# EAGLE design Parallel CS Prototype (EAGLE 7.2.0)

## Sheet 1 of 4: Inputs & FSYNC Switching
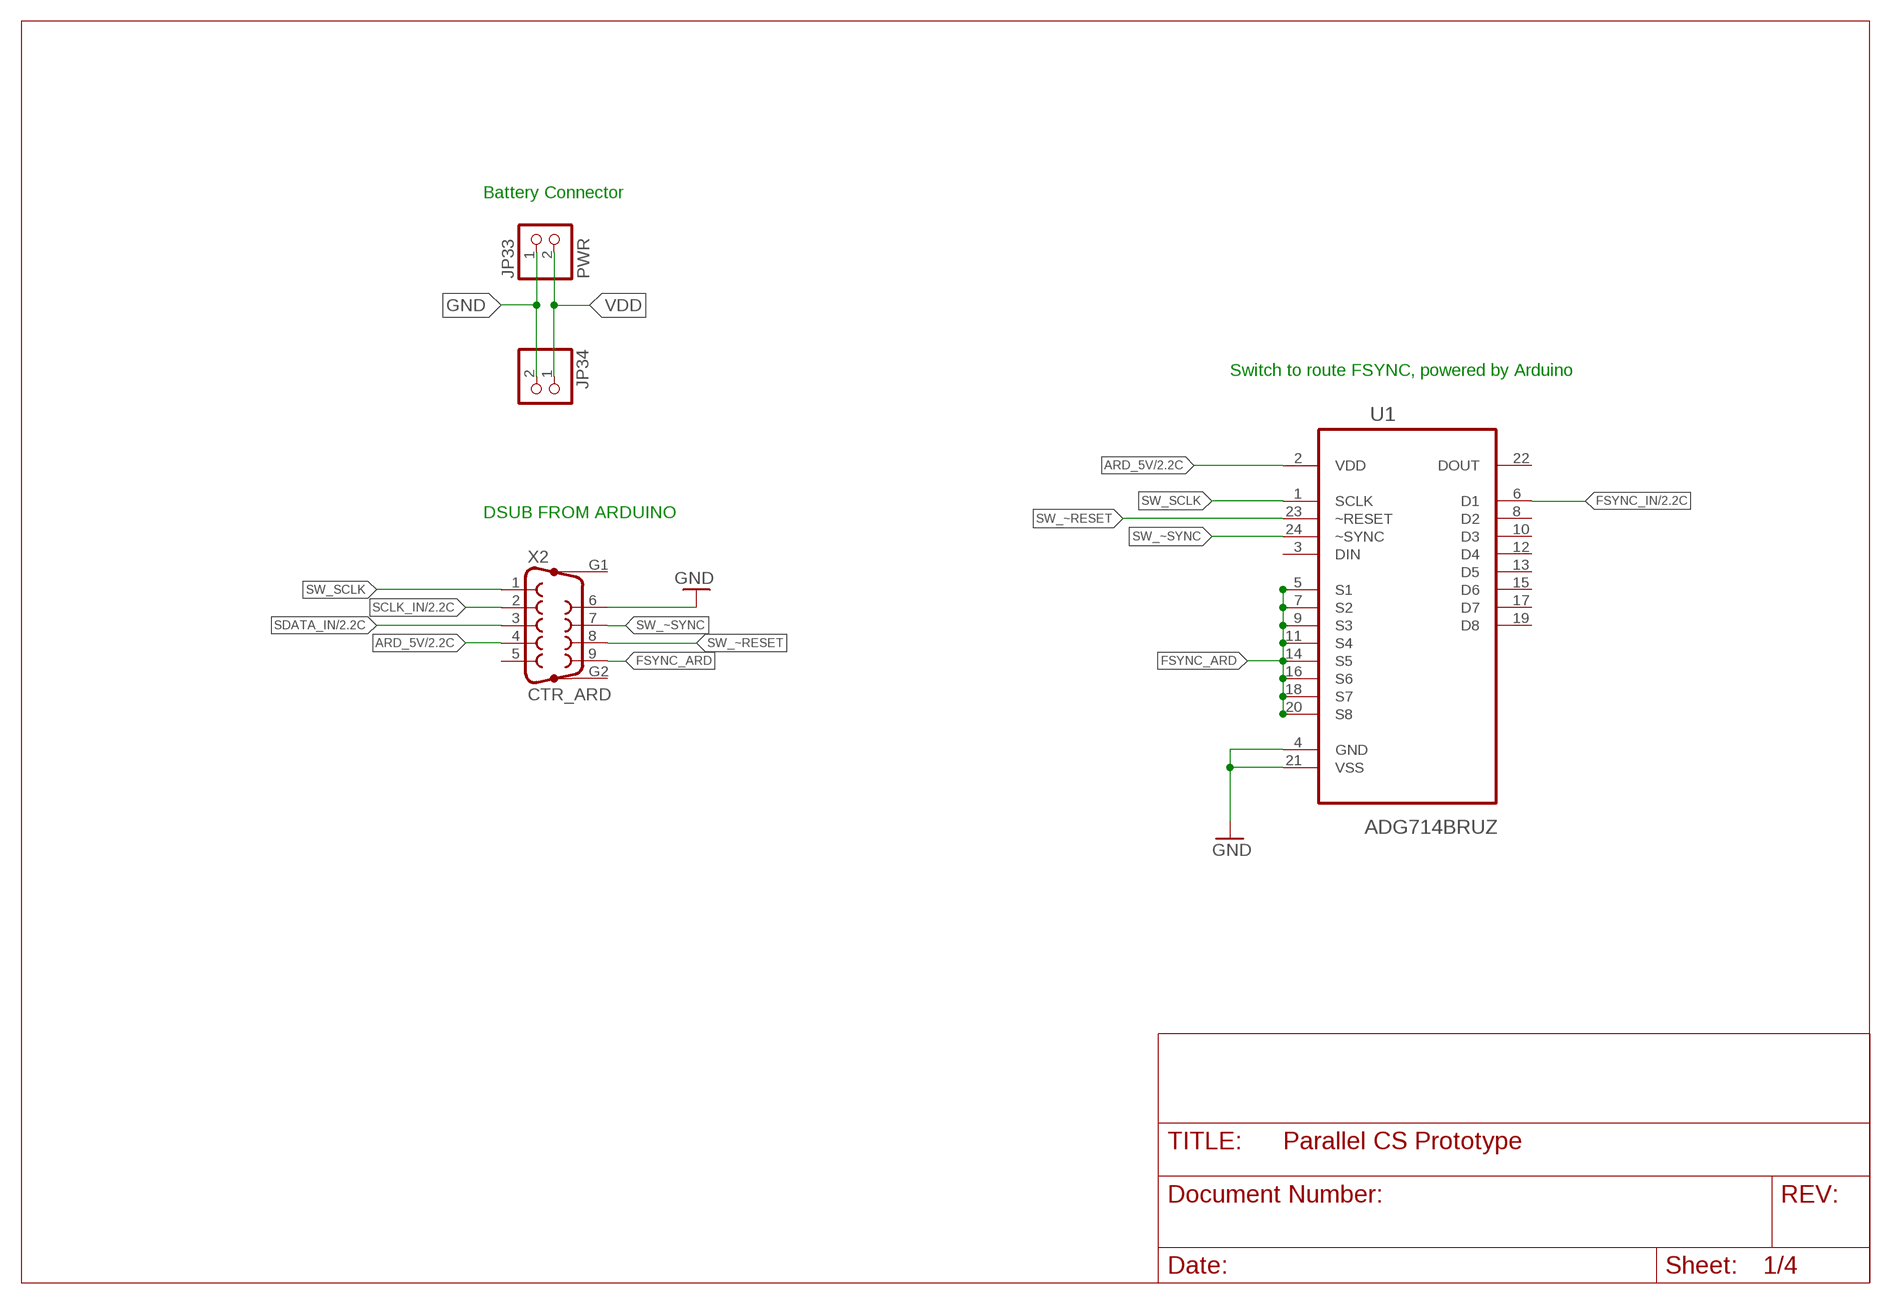
[diagram p0: schematic, sheet 1]

### Parts
JP33  PWR  PINHD-1X2  [1X02]
JP34  PINHD-1X2  [1X02]
U1  ADG714BRUZ  [SOP65P640X120-24N]
X2  CTR_ARD  F09HP  [F09HP]

### Nets
ARD_5V: U1.2(VDD) X2.4 ; also sheet 2
FSYNC_ARD: U1.5(S1) U1.7(S2) U1.9(S3) U1.11(S4) U1.14(S5) U1.16(S6) U1.18(S7) U1.20(S8) X2.9
FSYNC_IN: U1.6(D1) ; also sheet 2
GND: JP33.1 JP34.2 U1.4(GND) U1.21(VSS) X2.6 ; also sheet 2
SCLK_IN: X2.2 ; also sheet 2
SDATA_IN: X2.3 ; also sheet 2
SW_SCLK: U1.1(SCLK) X2.1
SW_~RESET: U1.23(~RESET) X2.8
SW_~SYNC: U1.24(~SYNC) X2.7
VDD: JP33.2 JP34.1 ; also sheet 2
Unconnected: U1.3(DIN) U1.8(D2) U1.10(D3) U1.12(D4) U1.13(D5) U1.15(D6) U1.17(D7) U1.19(D8) U1.22(DOUT) X2.5 X2.G1 X2.G2

### Notes on the sheet
- Battery Connector
- Switch to route FSYNC, powered by Arduino
- DSUB FROM ARDUINO

## Sheet 2 of 4: Isolated power supply & digital isolator
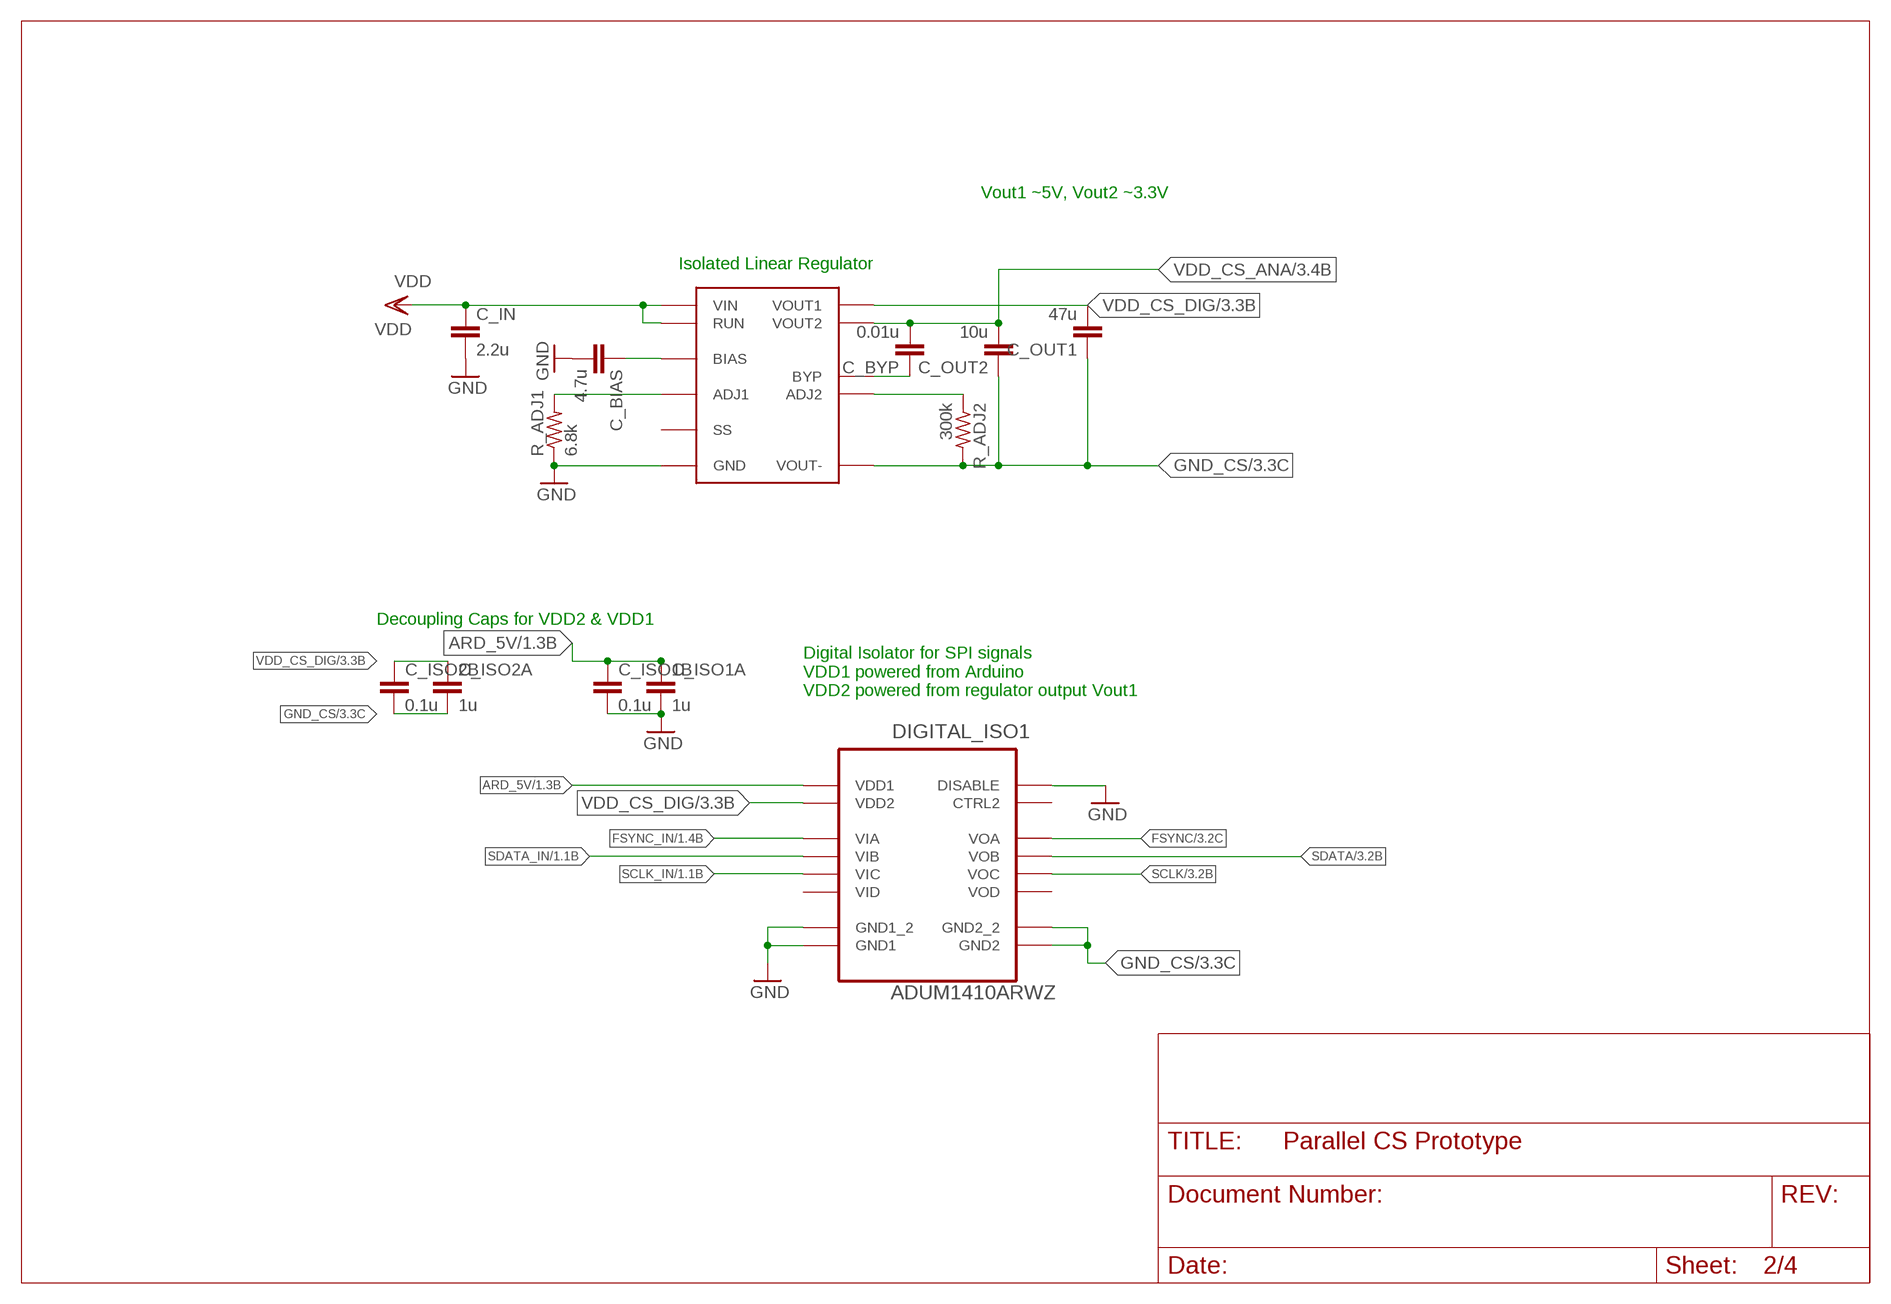
[diagram p1: schematic, sheet 2]

### Parts
C_BIAS  4.7u  C-EUC0805  [C0805]
C_BYP  0.01u  C-EUC0201  [C0201]
C_IN  2.2u  C-EUC0805  [C0805]
C_ISO1A  1u  C-EUC0402  [C0402]
C_ISO1B  0.1u  C-EUC0402  [C0402]
C_ISO2A  1u  C-EUC0402  [C0402]
C_ISO2B  0.1u  C-EUC0402  [C0402]
C_OUT1  47u  C-EUC0805  [C0805]
C_OUT2  10u  C-EUC0805  [C0805]
DIGITAL_ISO1  ADUM1410ARWZ  [SOIC127P1032X265-16N]
R_ADJ1  6.8k  R-US_R0201  [R0201]
R_ADJ2  300k  R-US_R0201  [R0201]
U$1  LTM8048  [BGA-49]

### Nets
ARD_5V: C_ISO1A.1 C_ISO1B.1 DIGITAL_ISO1.1(VDD1) ; also sheet 1
FSYNC: DIGITAL_ISO1.14(VOA) ; also sheet 3
FSYNC_IN: DIGITAL_ISO1.3(VIA) ; also sheet 1
GND: C_BIAS.2 C_IN.2 C_ISO1A.2 C_ISO1B.2 DIGITAL_ISO1.2(GND1_2) DIGITAL_ISO1.7(DISABLE) DIGITAL_ISO1.8(GND1) R_ADJ1.1 U$1.GND@1(GND) U$1.GND@2(GND) U$1.GND@3(GND) U$1.GND@4(GND) U$1.GND@5(GND) U$1.GND@6(GND) U$1.GND@7(GND) U$1.GND@8(GND) U$1.GND@9(GND) U$1.GND@10(GND) U$1.GND@11(GND) U$1.GND@12(GND) U$1.GND@13(GND) U$1.GND@14(GND) U$1.GND@15(GND) U$1.GND@16(GND) ; also sheet 1
GND_CS: C_ISO2A.2 C_ISO2B.2 C_OUT1.1 C_OUT2.1 DIGITAL_ISO1.9(GND2_2) DIGITAL_ISO1.15(GND2) R_ADJ2.2 U$1.VOUT-@1(VOUT-) U$1.VOUT-@2(VOUT-) U$1.VOUT-@3(VOUT-) U$1.VOUT-@4(VOUT-) U$1.VOUT-@5(VOUT-) U$1.VOUT-@6(VOUT-) U$1.VOUT-@7(VOUT-) U$1.VOUT-@8(VOUT-) U$1.VOUT-@9(VOUT-) ; also sheet 3
N$2: C_BYP.1 U$1.BYP
N$10: C_BIAS.1 U$1.BIAS
N$11: R_ADJ1.2 U$1.ADJ1
N$13: R_ADJ2.1 U$1.ADJ2
SCLK: DIGITAL_ISO1.12(VOC) ; also sheet 3
SCLK_IN: DIGITAL_ISO1.5(VIC) ; also sheet 1
SDATA: DIGITAL_ISO1.13(VOB) ; also sheet 3
SDATA_IN: DIGITAL_ISO1.4(VIB) ; also sheet 1
VDD: C_IN.1 U$1.RUN U$1.VIN@1(VIN) U$1.VIN@2(VIN) U$1.VIN@3(VIN) U$1.VIN@4(VIN) ; also sheet 1
VDD_CS_ANA: C_BYP.2 C_OUT2.2 U$1.VOUT2@1(VOUT2) U$1.VOUT2@2(VOUT2) U$1.VOUT2@3(VOUT2) U$1.VOUT2@4(VOUT2) ; also sheet 3
VDD_CS_DIG: C_ISO2A.1 C_ISO2B.1 C_OUT1.2 DIGITAL_ISO1.16(VDD2) U$1.VOUT1@1(VOUT1) U$1.VOUT1@2(VOUT1) U$1.VOUT1@3(VOUT1) U$1.VOUT1@4(VOUT1) U$1.VOUT1@5(VOUT1) U$1.VOUT1@6(VOUT1) ; also sheet 3
Unconnected: DIGITAL_ISO1.6(VID) DIGITAL_ISO1.10(CTRL2) DIGITAL_ISO1.11(VOD) U$1.SS

### Notes on the sheet
- Vout1 ~5V, Vout2 ~3.3V
- Isolated Linear Regulator
- Decoupling Caps for VDD2 & VDD1
- Digital Isolator for SPI signals
  VDD1 powered from Arduino
  VDD2 powered from regulator output Vout1

## Sheet 3 of 4: Current Source Block
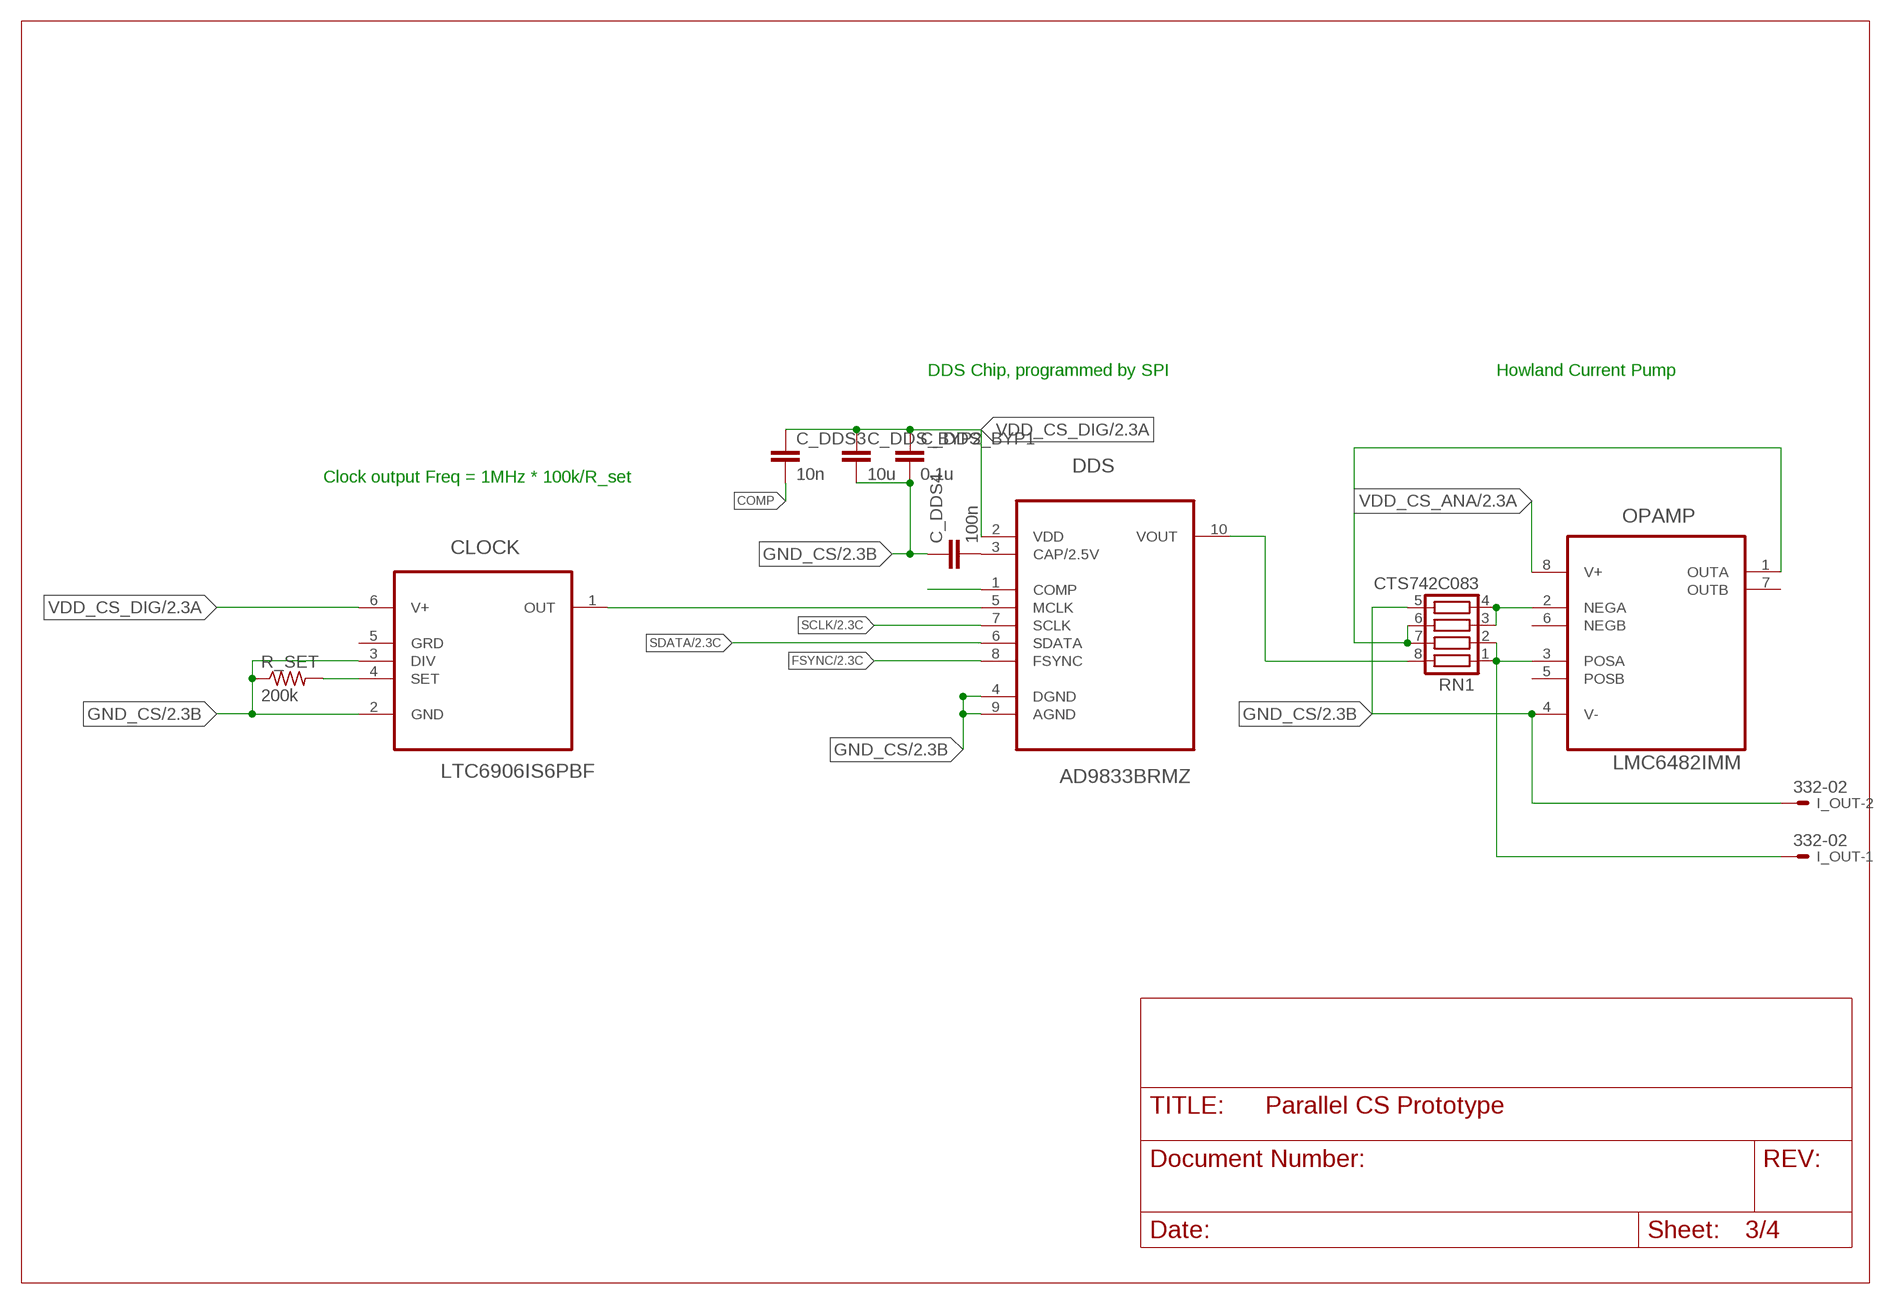
[diagram p2: schematic, sheet 3]

### Parts
C_DDS3  10n  C-EUC0402  [C0402]
C_DDS4  100n  C-EUC0402  [C0402]
C_DDS_BYP1  0.1u  C-EUC0402  [C0402]
C_DDS_BYP2  10u  C-EUC0402  [C0402]
CLOCK  LTC6906IS6PBF  [SOT95P280X100-6N]
DDS  AD9833BRMZ  [SOP50P490X110-10N]
I_OUT  332-02  [332-02]
OPAMP  LMC6482IMM  [SOP65P490X109-8N]
R_SET  200k  R-US_R0603  [R0603]
RN1  CTS742C083  [CTS742C083]

### Nets
CLK_OUT: CLOCK.1(OUT) DDS.5(MCLK)
COMP: C_DDS3.2 DDS.1(COMP)
FSYNC: DDS.8(FSYNC) ; also sheet 2
GND_CS: C_DDS4.1 C_DDS_BYP1.2 C_DDS_BYP2.2 CLOCK.2(GND) CLOCK.3(DIV) DDS.4(DGND) DDS.9(AGND) I_OUT.2 OPAMP.4(V-) R_SET.1 RN1.5 ; also sheet 2
IOUT: I_OUT.1 OPAMP.3(POSA) RN1.1 RN1.2
N$1: C_DDS4.2 DDS.3(CAP/2.5V)
N$3: OPAMP.2(NEGA) RN1.3 RN1.4
N$7: OPAMP.1(OUTA) RN1.6 RN1.7
N$8: CLOCK.4(SET) R_SET.2
SCLK: DDS.7(SCLK) ; also sheet 2
SDATA: DDS.6(SDATA) ; also sheet 2
V_SINE: DDS.10(VOUT) RN1.8
VDD_CS_ANA: OPAMP.8(V+) ; also sheet 2
VDD_CS_DIG: C_DDS3.1 C_DDS_BYP1.1 C_DDS_BYP2.1 CLOCK.6(V+) DDS.2(VDD) ; also sheet 2
Unconnected: CLOCK.5(GRD) OPAMP.5(POSB) OPAMP.6(NEGB) OPAMP.7(OUTB)

### Notes on the sheet
- DDS Chip, programmed by SPI | Howland Current Pump
- Clock output Freq = 1MHz * 100k/R_set

## Sheet 4 of 4: Outputs
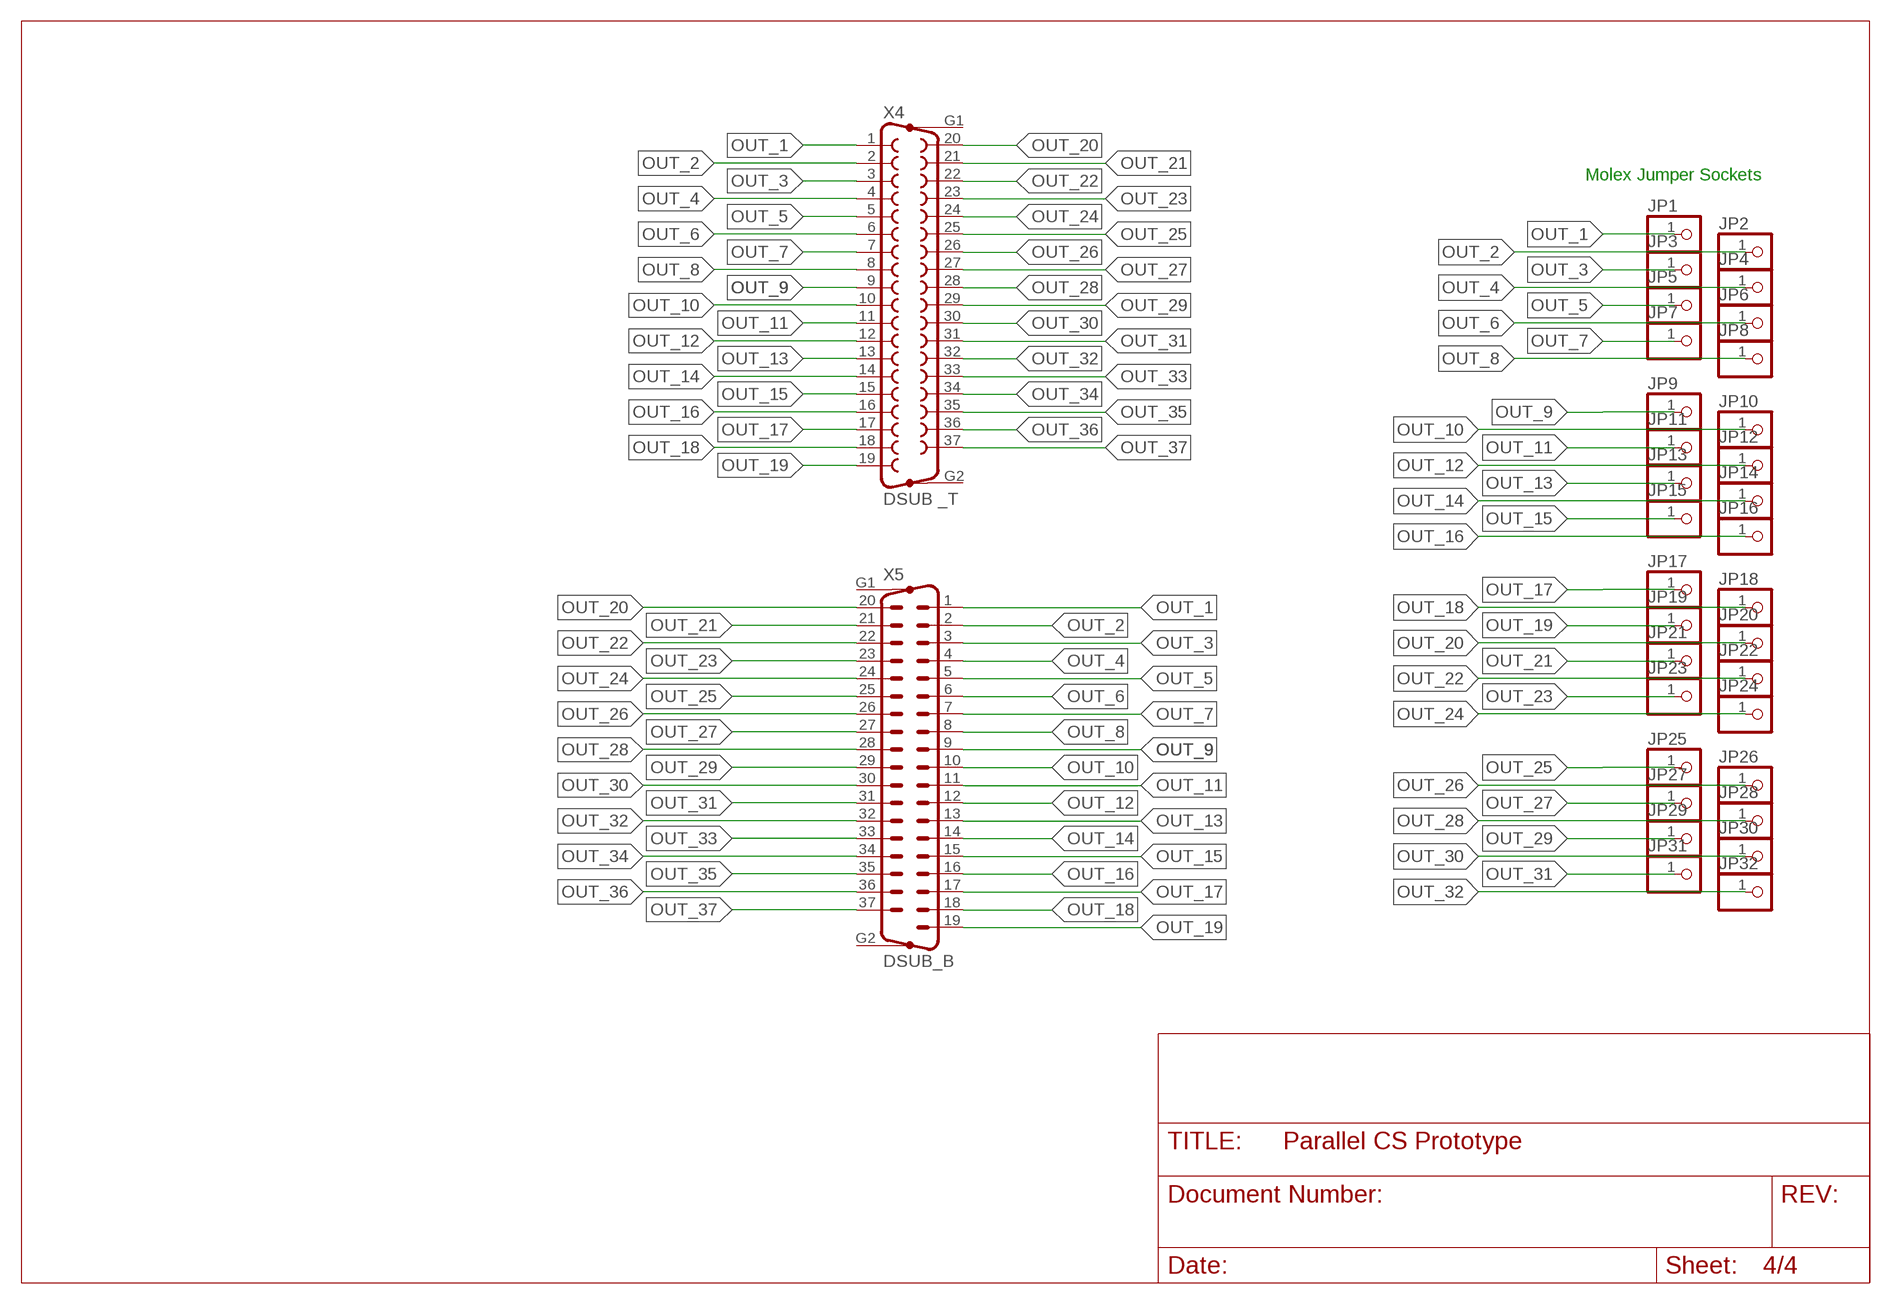
[diagram p3: schematic, sheet 4]

### Parts
JP1  PINHD-1X1  [1X01]
JP2  PINHD-1X1  [1X01]
JP3  PINHD-1X1  [1X01]
JP4  PINHD-1X1  [1X01]
JP5  PINHD-1X1  [1X01]
JP6  PINHD-1X1  [1X01]
JP7  PINHD-1X1  [1X01]
JP8  PINHD-1X1  [1X01]
JP9  PINHD-1X1  [1X01]
JP10  PINHD-1X1  [1X01]
JP11  PINHD-1X1  [1X01]
JP12  PINHD-1X1  [1X01]
JP13  PINHD-1X1  [1X01]
JP14  PINHD-1X1  [1X01]
JP15  PINHD-1X1  [1X01]
JP16  PINHD-1X1  [1X01]
JP17  PINHD-1X1  [1X01]
JP18  PINHD-1X1  [1X01]
JP19  PINHD-1X1  [1X01]
JP20  PINHD-1X1  [1X01]
JP21  PINHD-1X1  [1X01]
JP22  PINHD-1X1  [1X01]
JP23  PINHD-1X1  [1X01]
JP24  PINHD-1X1  [1X01]
JP25  PINHD-1X1  [1X01]
JP26  PINHD-1X1  [1X01]
JP27  PINHD-1X1  [1X01]
JP28  PINHD-1X1  [1X01]
JP29  PINHD-1X1  [1X01]
JP30  PINHD-1X1  [1X01]
JP31  PINHD-1X1  [1X01]
JP32  PINHD-1X1  [1X01]
X4  DSUB _T  F37HP  [F37HP]
X5  DSUB_B  M37HP  [M37HP]

### Nets
OUT_1: JP1.1 X4.1 X5.1
OUT_2: JP2.1 X4.2 X5.2
OUT_3: JP3.1 X4.3 X5.3
OUT_4: JP4.1 X4.4 X5.4
OUT_5: JP5.1 X4.5 X5.5
OUT_6: JP6.1 X4.6 X5.6
OUT_7: JP7.1 X4.7 X5.7
OUT_8: JP8.1 X4.8 X5.8
OUT_9: JP9.1 X4.9 X5.9
OUT_10: JP10.1 X4.10 X5.10
OUT_11: JP11.1 X4.11 X5.11
OUT_12: JP12.1 X4.12 X5.12
OUT_13: JP13.1 X4.13 X5.13
OUT_14: JP14.1 X4.14 X5.14
OUT_15: JP15.1 X4.15 X5.15
OUT_16: JP16.1 X4.16 X5.16
OUT_17: JP17.1 X4.17 X5.17
OUT_18: JP18.1 X4.18 X5.18
OUT_19: JP19.1 X4.19 X5.19
OUT_20: JP20.1 X4.20 X5.20
OUT_21: JP21.1 X4.21 X5.21
OUT_22: JP22.1 X4.22 X5.22
OUT_23: JP23.1 X4.23 X5.23
OUT_24: JP24.1 X4.24 X5.24
OUT_25: JP25.1 X4.25 X5.25
OUT_26: JP26.1 X4.26 X5.26
OUT_27: JP27.1 X4.27 X5.27
OUT_28: JP28.1 X4.28 X5.28
OUT_29: JP29.1 X4.29 X5.29
OUT_30: JP30.1 X4.30 X5.30
OUT_31: JP31.1 X4.31 X5.31
OUT_32: JP32.1 X4.32 X5.32
OUT_33: X4.33 X5.33
OUT_34: X4.34 X5.34
OUT_35: X4.35 X5.35
OUT_36: X4.36 X5.36
OUT_37: X4.37 X5.37
Unconnected: X4.G1 X4.G2 X5.G1 X5.G2

### Notes on the sheet
- Molex Jumper Sockets

## Library data of the parts
C_BIAS C_BYP C_DDS3 C_DDS4 C_DDS_BYP1 C_DDS_BYP2 C_IN C_ISO1A C_ISO1B C_ISO2A C_ISO2B C_OUT1 C_OUT2 = resistor:C-EU: CAPACITOR, European symbol
CLOCK = LTC6906:LTC6906IS6PBF: Micropower, 10kHz to 1MHz Resistor Set Oscillator in SOT-23; MPN: LTC6906IS6#PBF; OC_FARNELL: 1432109; OC_NEWARK: 10R6975; PACKAGE: TSOT-23-6; SUPPLIER: Linear Technology
DDS = ad9833:AD9833BRMZ: Low Power 12.65 mW, 2.3 V to 5.5 V,Low Power 12.65 mW, 2.3 V to 5.5 V,Low Power 12.65 mW, 2.3 V to 5.5 V,Programmable Waveform Generator; MPN: AD9833BRMZ; OC_FARNELL: 1581966; OC_NEWARK: 19M1014; PACKAGE: MSOP-10; SUPPLIER: Analog Devices
DIGITAL_ISO1 = SwitchBoard:ADUM1410ARWZ: ISOLATOR, DGTL, 4CHAN; MPN: ADUM1410ARWZ; OC_FARNELL: 2067770; OC_NEWARK: 73T8174; PACKAGE: 16-Lead SOIC_W; SUPPLIER: Analog Devices
I_OUT = con-garry:332-02: 2 Pin - 2mm Dual Row Source: www.mpe-connector.de / garry_shortform_2012.pdf
JP1-JP32 = SwitchBoard:PINHD-1X1: PIN HEADER
JP33 = pinhead:PINHD-1X2: PIN HEADER
JP34 = SwitchBoard:PINHD-1X2: PIN HEADER
OPAMP = LMC6482:LMC6482IMM: OpAmpIC; MPN: LMC6482IMM; OC_FARNELL: 1468890; OC_NEWARK: 83F3826; PACKAGE: MSOP-8; SUPPLIER: NationalSemiconductor
R_ADJ1 R_ADJ2 R_SET = resistor:R-US_: RESISTOR, American symbol
RN1 = resistor-net:CTS742C083: Chip Resistor Array 4 Single Resistor Source: http://www.ctscorp.com/components/Datasheets/CTSChipArrayDs.pdf; OC_FARNELL: unknown; OC_NEWARK: unknown
U1 = SwitchBoard:ADG714BRUZ: CMOS, Low Voltage Serially Controlled, Octal SPST Switches; MPN: ADG714BRUZ; OC_FARNELL: 9604367; OC_NEWARK: 59K1531; PACKAGE: TSSOP-24; SUPPLIER: Analog Devices
U$1 = LTM8048:LTM8048
X2 = con-subd:F09HP: SUB-D; OC_FARNELL: unknown; OC_NEWARK: unknown
X4 = con-subd:F37HP: SUB-D; OC_FARNELL: unknown; OC_NEWARK: unknown
X5 = con-subd:M37HP: SUB-D; OC_FARNELL: unknown; OC_NEWARK: unknown

## Board
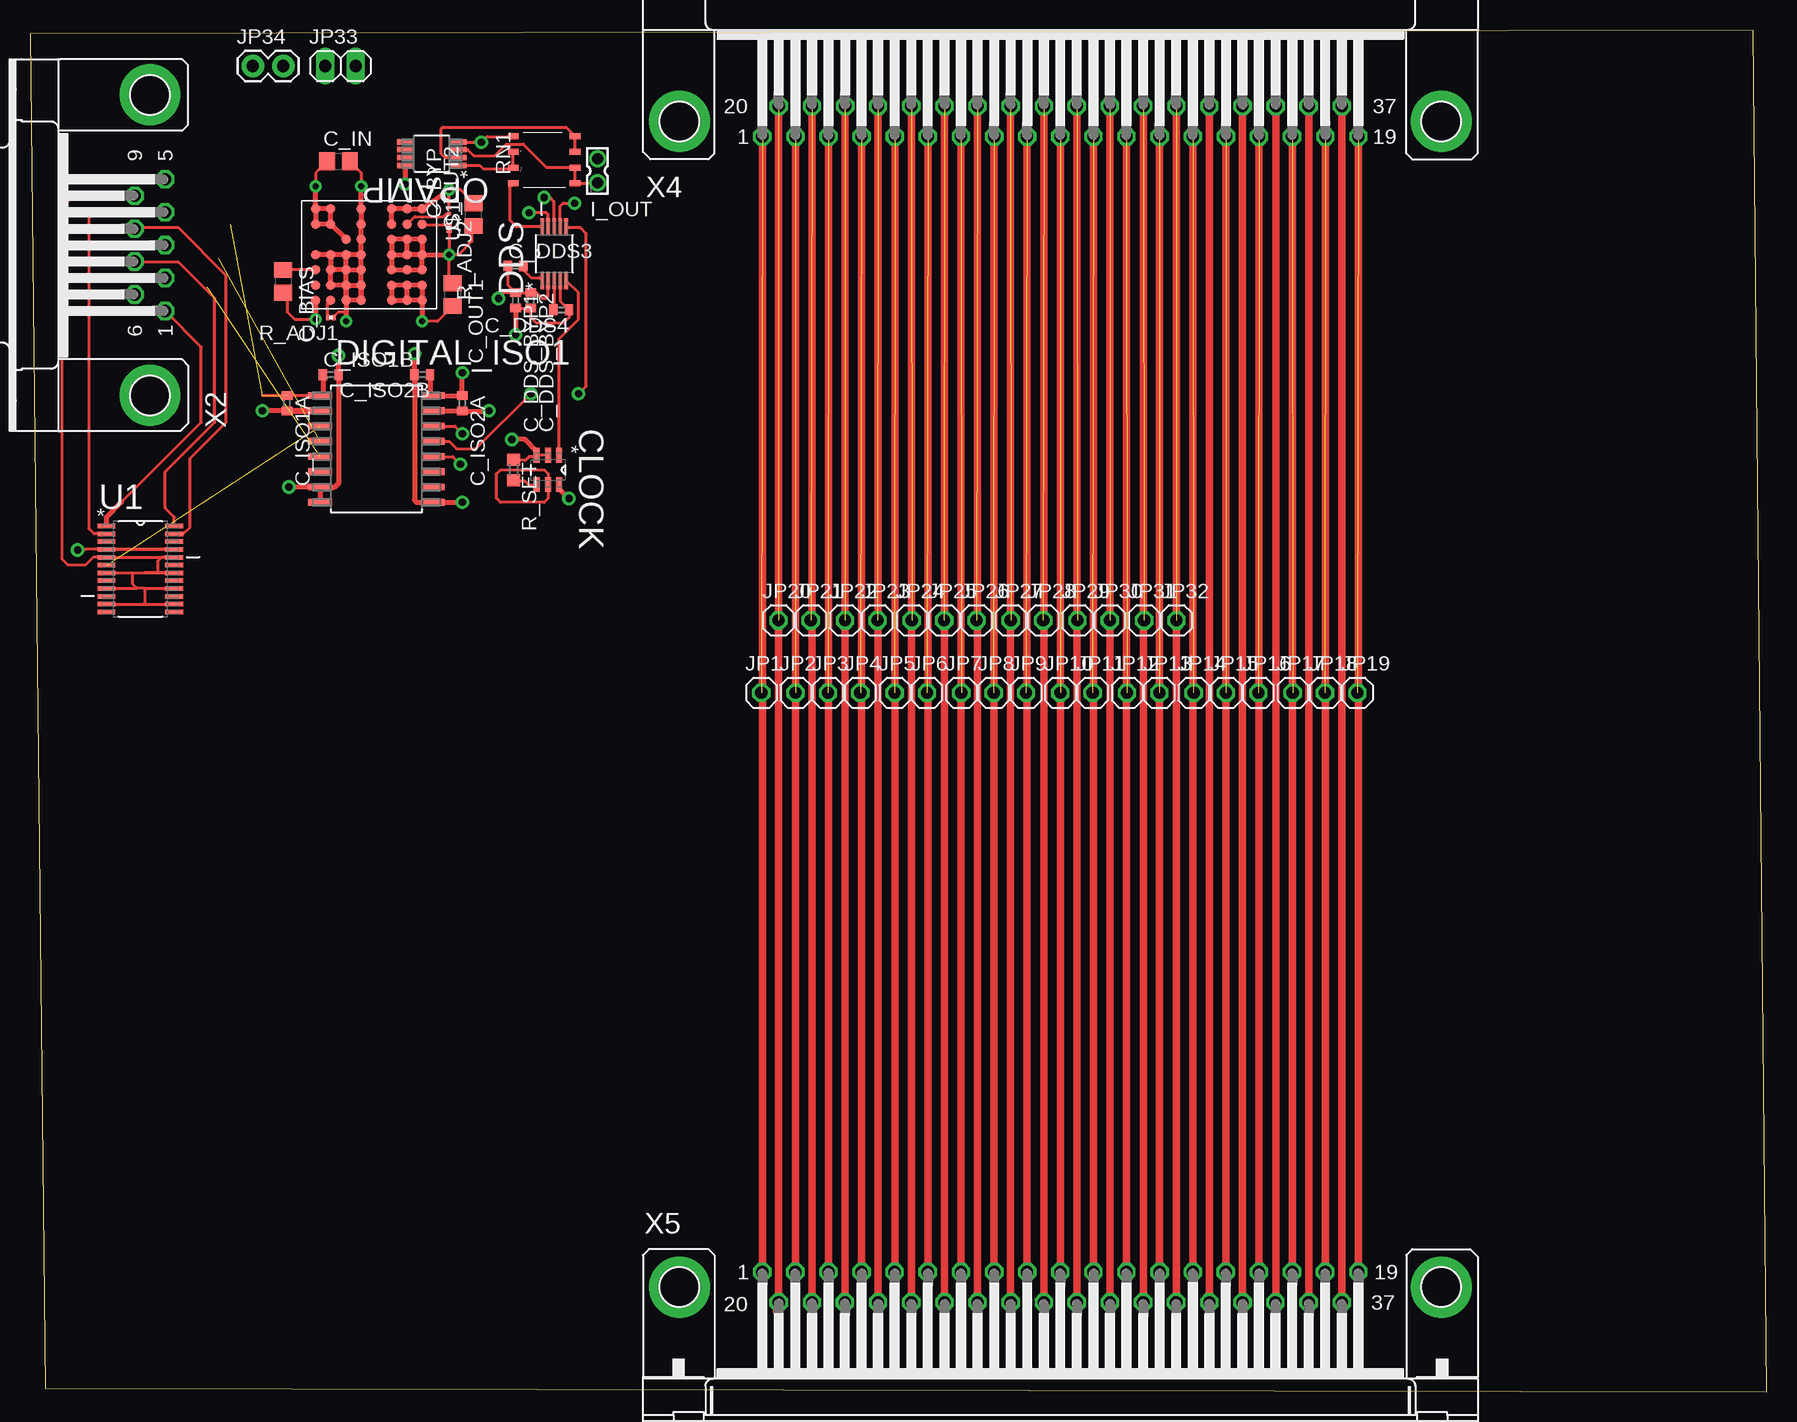
[diagram p4: board, top side]
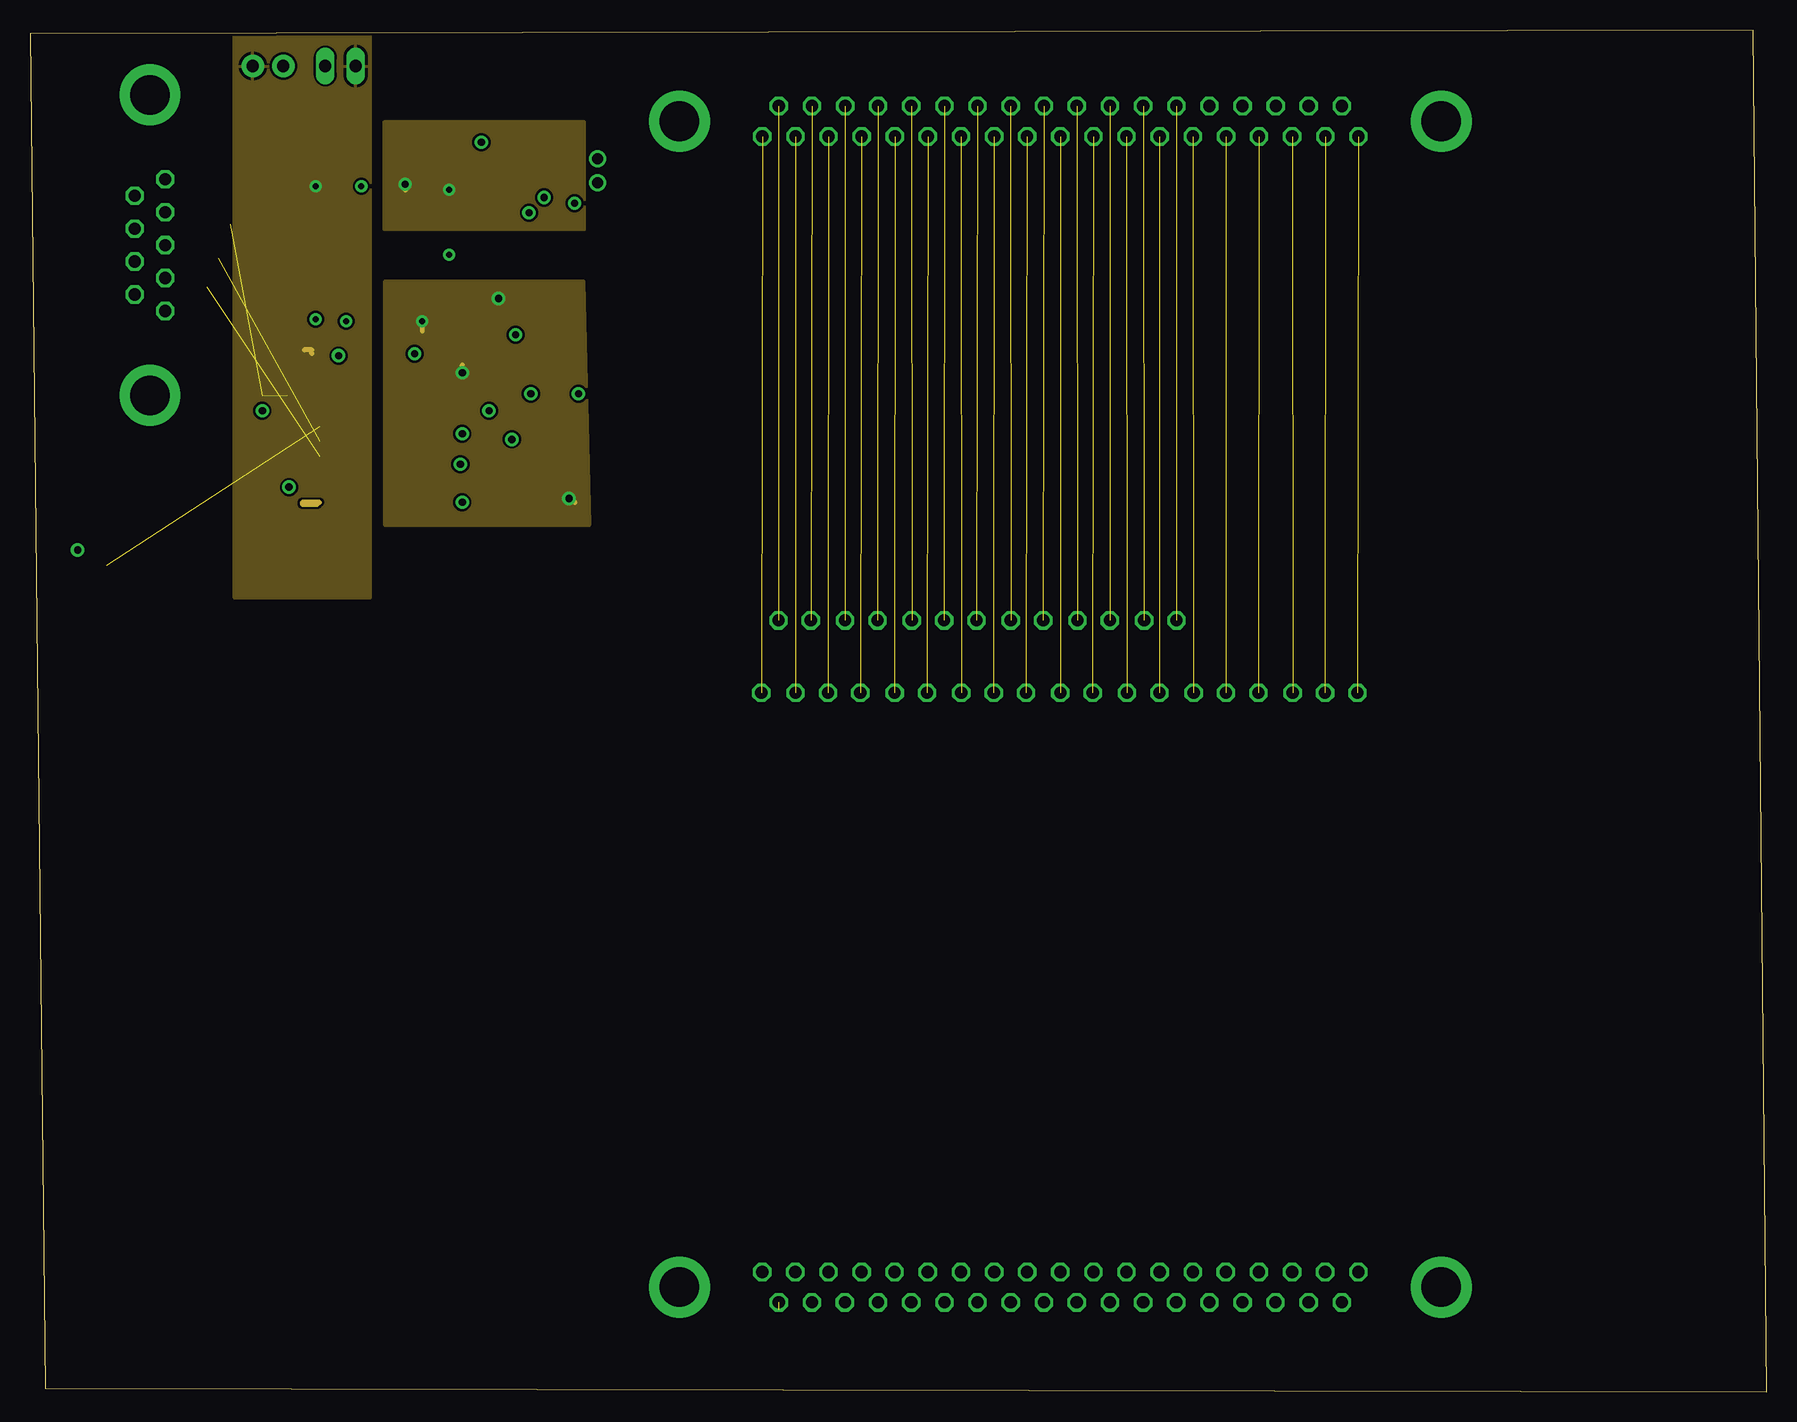
[diagram p5: board, inner layer Vdd]
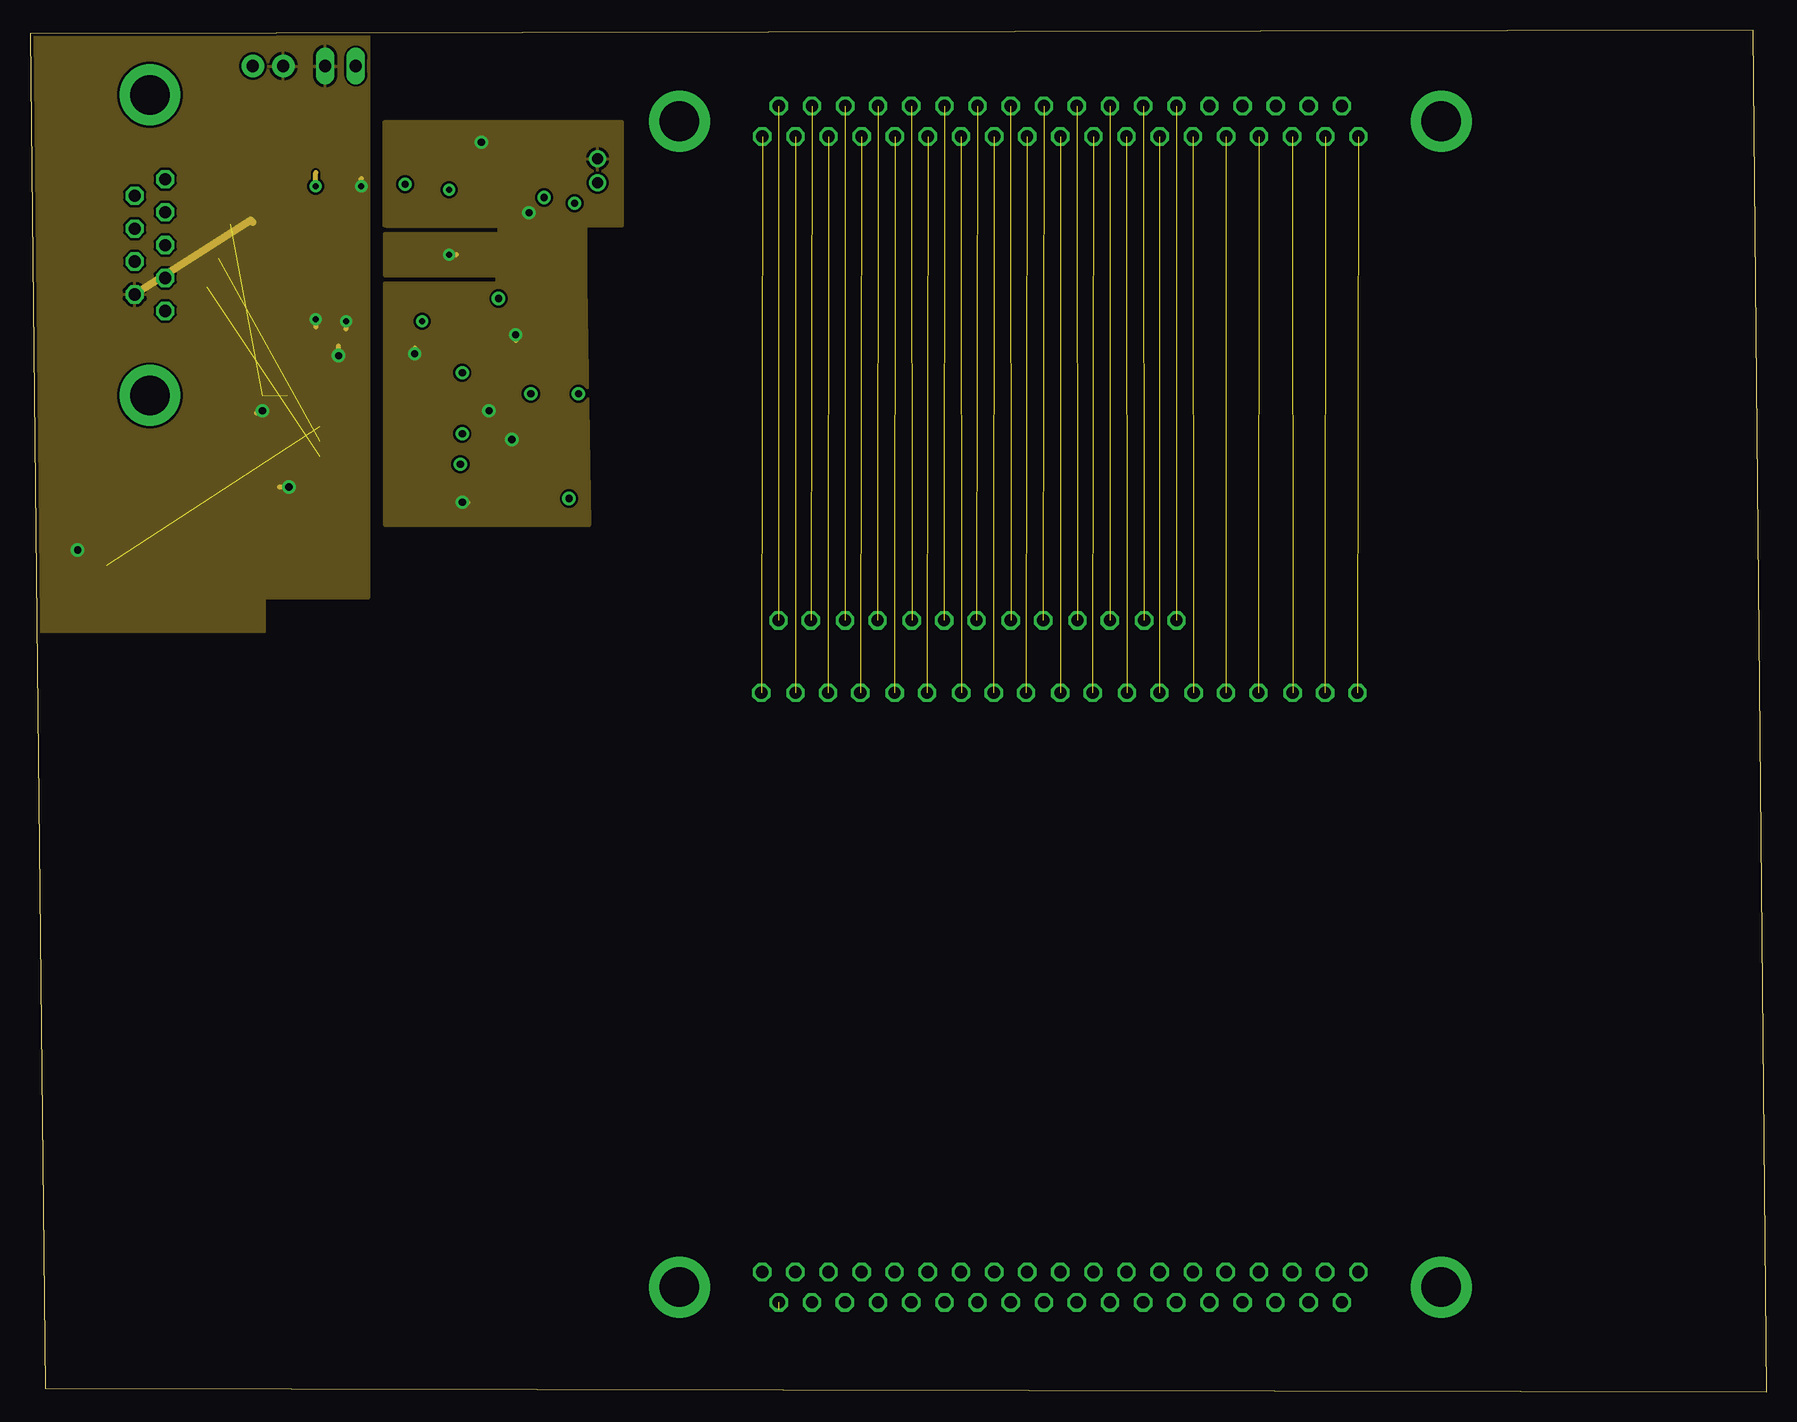
[diagram p6: board, inner layer Gnd]
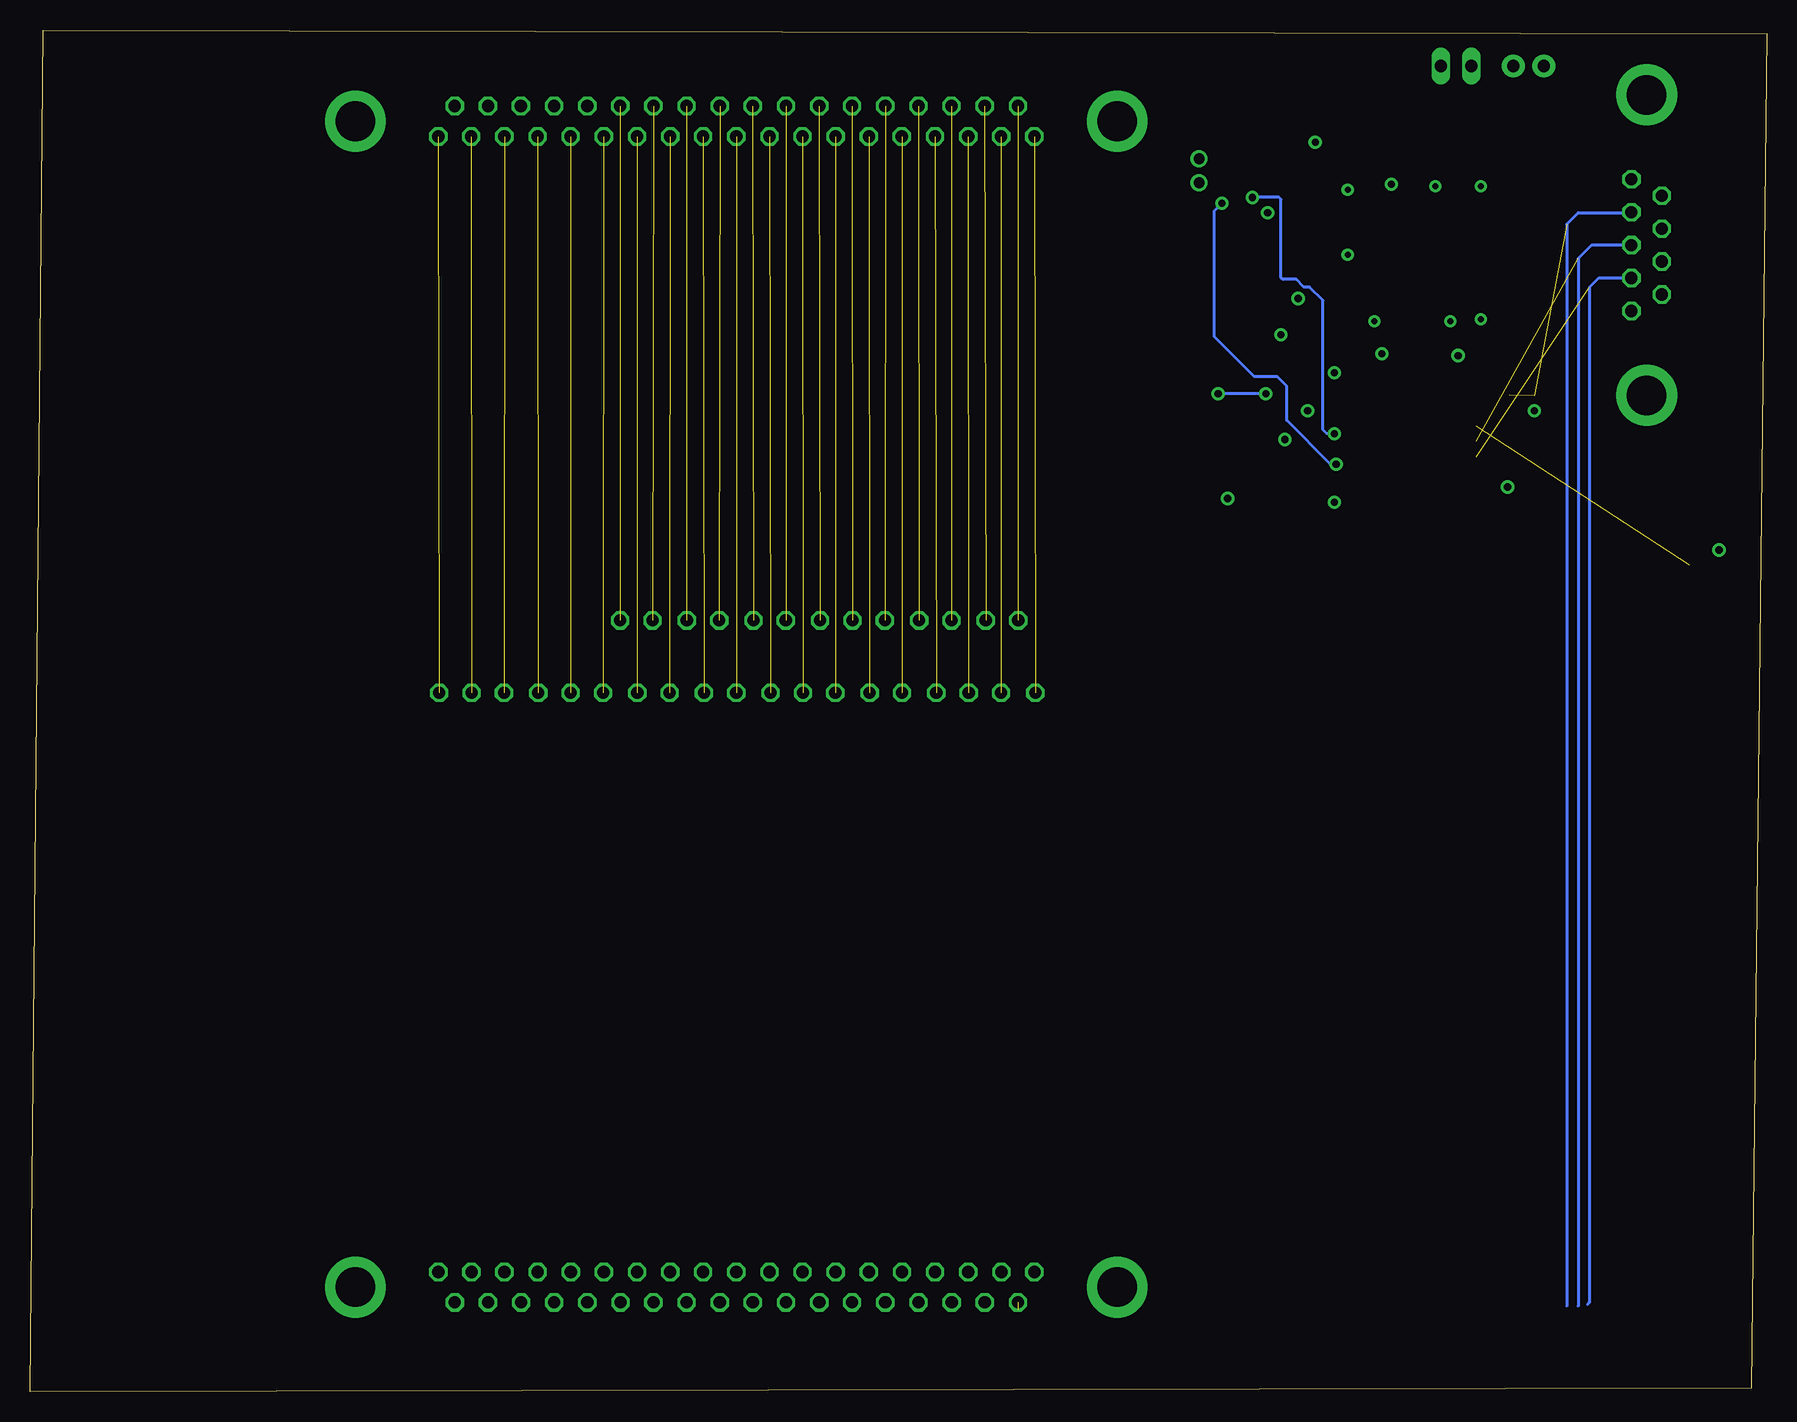
[diagram p7: board, bottom side, seen from below]

Size 144.76 x 113.49 mm. Coordinates in mm from the lower left corner, seen from the top.
Outline: 1.27,0.32 144.76,0 143.65,113.49 0,113.18 1.27,0.32
Copper layers (1*2*15*16): Top 0.035mm / dielectric 1.5mm / Vdd 0.035mm / dielectric 0.15mm / Gnd 0.035mm / dielectric 0.2mm / Bottom 0.035mm
Design rules "pcbtrain *": minimum track width 0.2mm, minimum drill 0.4mm, track to track 0.2mm, track to pad 0.2mm, pad to pad 0.2mm, via to via 0.2mm, smd to smd 0mil, copper to edge 10mil, drill to drill 0.2mm, minimum pad ring 10mil, minimum via ring 10mil, stop-mask expansion 0.125mm, vias tented up to drill 0mil, thermal gap 10mil

### Footprints (pad centres in the part's own frame; a part is rotated, then mirrored left to right if it is on the bottom)
C0805 = smd 1.3 x 1.5: 1 -0.95,0; 2 0.95,0
C0201 = smd 0.25 x 0.35: 1 -0.25,0; 2 0.25,0
C0402 = smd 0.7 x 0.9: 1 -0.65,0; 2 0.65,0
SOT95P280X100-6N = smd 1.219 x 0.508: 1 -1.219,0.94; 2 -1.219,0; 3 -1.219,-0.94; 4 1.219,-0.94; 5 1.219,0; 6 1.219,0.94
SOP50P490X110-10N = smd 1.422 x 0.305: 1 -2.235,0.991; 2 -2.235,0.508; 3 -2.235,0; 4 -2.235,-0.508; 5 -2.235,-0.991; 6 2.235,-0.991; 7 2.235,-0.508; 8 2.235,0; 9 2.235,0.508; 10 2.235,0.991
SOIC127P1032X265-16N = smd 1.981 x 0.559: 1 -4.699,4.445; 2 -4.699,3.175; 3 -4.699,1.905; 4 -4.699,0.635; 5 -4.699,-0.635; 6 -4.699,-1.905; 7 -4.699,-3.175; 8 -4.699,-4.445; 9 4.699,-4.445; 10 4.699,-3.175; 11 4.699,-1.905; 12 4.699,-0.635; 13 4.699,0.635; 14 4.699,1.905; 15 4.699,3.175; 16 4.699,4.445
332-02 = drill 0.9 pad 1.27: 1 0,-1; 2 0,1
1X01 = drill 1.016 octagon: 1 0,0
1X02 = drill 1.016 long: 1 -1.27,0; 2 1.27,0
1X02' = drill 1.016 pad 1.88: 1 0,0; 2 2.54,0
SOP65P490X109-8N = smd 1.372 x 0.457: 1 -2.21,0.965; 2 -2.21,0.33; 3 -2.21,-0.33; 4 -2.21,-0.965; 5 2.21,-0.965; 6 2.21,-0.33; 7 2.21,0.33; 8 2.21,0.965
R0201 = smd 0.28 x 0.43: 1 -0.255,0; 2 0.255,0
R0603 = smd 1 x 1.1: 1 -0.85,0; 2 0.85,0
CTS742C083 = smd 0.5 x 0.9: 1 -2.47,-3.848; 2 -1.162,-3.848; 3 0.146,-3.848; 4 1.454,-3.848; 5 1.454,1.308; 6 0.146,1.308; 7 -1.162,1.308; 8 -2.47,1.308
SOP65P640X120-24N = smd 1.473 x 0.356: 1 -2.819,3.581; 2 -2.819,2.921; 3 -2.819,2.286; 4 -2.819,1.626; 5 -2.819,0.965; 6 -2.819,0.33; 7 -2.819,-0.33; 8 -2.819,-0.965; 9 -2.819,-1.626; 10 -2.819,-2.286; 11 -2.819,-2.921; 12 -2.819,-3.581; 13 2.819,-3.581; 14 2.819,-2.921; 15 2.819,-2.286; 16 2.819,-1.626; 17 2.819,-0.965; 18 2.819,-0.33; 19 2.819,0.33; 20 2.819,0.965; 21 2.819,1.626; 22 2.819,2.286; 23 2.819,2.921; 24 2.819,3.581
BGA-49 = smd 0.78 x 0.78: ADJ1 3.81,-3.175; ADJ2 -2.54,4.445; BIAS 1.27,-4.445; BYP -2.54,3.175; GND@1 -3.81,-0.635; GND@2 -2.54,-0.635; GND@3 -1.27,-0.635; GND@4 0,-0.635; GND@5 1.27,-0.635; GND@6 2.54,-0.635; GND@7 3.81,-0.635; GND@8 0,-1.905; GND@9 1.27,-1.905; GND@10 2.54,-1.905; GND@11 3.81,-1.905; GND@12 0,-3.175; GND@13 1.27,-3.175; GND@14 2.54,-3.175; GND@15 0,-4.445; GND@16 3.81,-4.445; RUN -1.27,-1.905; SS 2.54,-4.445; VIN@1 -3.81,-3.175; VIN@2 -2.54,-3.175; VIN@3 -3.81,-4.445; VIN@4 -2.54,-4.445; VOUT1@1 2.54,4.445; VOUT1@2 2.54,3.175; VOUT1@3 2.54,1.905; VOUT1@4 3.81,4.445; VOUT1@5 3.81,3.175; VOUT1@6 3.81,1.905; VOUT2@1 -3.81,4.445; VOUT2@2 -3.81,3.175; VOUT2@3 -3.81,1.905; VOUT2@4 -2.54,1.905; VOUT-@1 -1.27,4.445; VOUT-@2 -1.27,3.175; VOUT-@3 -1.27,1.905; VOUT-@4 0,4.445; VOUT-@5 0,3.175; VOUT-@6 0,1.905; VOUT-@7 1.27,4.445; VOUT-@8 1.27,3.175; VOUT-@9 1.27,1.905
F09HP = drill 1.016 octagon: 1 -5.486,-1.27; 2 -2.743,-1.27; 3 0,-1.27; 4 2.743,-1.27; 5 5.486,-1.27; 6 -4.115,1.27; 7 -1.372,1.27; 8 1.372,1.27; 9 4.115,1.27 | drill 3.302 pad 5.08: G1 -12.522,0; G2 12.522,0
F37HP = drill 1.016 octagon: 1 -24.841,-1.27; 2 -22.073,-1.27; 3 -19.329,-1.27; 4 -16.561,-1.27; 5 -13.792,-1.27; 6 -11.049,-1.27; 7 -8.28,-1.27; 8 -5.512,-1.27; 9 -2.769,-1.27; 10 0,-1.27; 11 2.769,-1.27; 12 5.512,-1.27; 13 8.28,-1.27; 14 11.049,-1.27; 15 13.818,-1.27; 16 16.561,-1.27; 17 19.329,-1.27; 18 22.098,-1.27; 19 24.841,-1.27; 20 -23.47,1.27; 21 -20.701,1.27; 22 -17.932,1.27; 23 -15.189,1.27; 24 -12.421,1.27; 25 -9.652,1.27; 26 -6.909,1.27; 27 -4.14,1.27; 28 -1.372,1.27; 29 1.372,1.27; 30 4.14,1.27; 31 6.909,1.27; 32 9.677,1.27; 33 12.421,1.27; 34 15.189,1.27; 35 17.958,1.27; 36 20.701,1.27; 37 23.47,1.27 | drill 3.302 pad 5.08: G1 -31.75,0; G2 31.75,0
M37HP = drill 1.016 octagon: 1 -24.841,1.27; 2 -22.098,1.27; 3 -19.329,1.27; 4 -16.561,1.27; 5 -13.818,1.27; 6 -11.049,1.27; 7 -8.28,1.27; 8 -5.512,1.27; 9 -2.769,1.27; 10 0,1.27; 11 2.769,1.27; 12 5.512,1.27; 13 8.28,1.27; 14 11.049,1.27; 15 13.792,1.27; 16 16.561,1.27; 17 19.329,1.27; 18 22.073,1.27; 19 24.841,1.27; 20 -23.47,-1.27; 21 -20.701,-1.27; 22 -17.958,-1.27; 23 -15.189,-1.27; 24 -12.421,-1.27; 25 -9.652,-1.27; 26 -6.909,-1.27; 27 -4.14,-1.27; 28 -1.372,-1.27; 29 1.372,-1.27; 30 4.14,-1.27; 31 6.909,-1.27; 32 9.652,-1.27; 33 12.421,-1.27; 34 15.189,-1.27; 35 17.932,-1.27; 36 20.701,-1.27; 37 23.47,-1.27 | drill 3.302 pad 5.08: G1 -31.75,0; G2 31.75,0

### Placement (x,y rotation side)
C_BIAS  21.11,92.55 270 top
C_BYP  34.92,98.43 90 top
C_DDS3  40.48,93.82 0 top
C_DDS4  44.29,90.17 180 top
C_DDS_BYP1  40.48,90.96 270 top
C_DDS_BYP2  41.75,90.96 270 top
C_IN  25.72,102.55 0 top
C_ISO1A  21.43,82.39 270 top
C_ISO1B  25.08,84.77 0 top
C_ISO2A  36.04,82.39 270 top
C_ISO2B  32.7,84.77 180 top
C_OUT1  35.24,91.44 270 top
C_OUT2  36.99,98.11 90 top
CLOCK  43.18,76.84 270 top
DDS  43.7,94.85 90 top
DIGITAL_ISO1  28.89,78.58 0 top
I_OUT  47.31,101.76 0 top
JP1  60.96,58.26 0 top
JP2  63.82,58.26 0 top
JP3  66.52,58.26 0 top
JP4  69.22,58.26 0 top
JP5  72.07,58.26 0 top
JP6  74.77,58.26 0 top
JP7  77.63,58.26 0 top
JP8  80.33,58.26 0 top
JP9  83.03,58.26 0 top
JP10  85.88,58.26 0 top
JP11  88.58,58.26 0 top
JP12  91.44,58.26 0 top
JP13  94.14,58.26 0 top
JP14  97,58.26 0 top
JP15  99.7,58.26 0 top
JP16  102.39,58.26 0 top
JP17  105.25,58.26 0 top
JP18  107.95,58.26 0 top
JP19  110.65,58.26 0 top
JP20  62.39,64.29 0 top
JP21  65.09,64.29 0 top
JP22  67.94,64.29 0 top
JP23  70.64,64.29 0 top
JP24  73.5,64.29 0 top
JP25  76.2,64.29 0 top
JP26  78.9,64.29 0 top
JP27  81.76,64.29 0 top
JP28  84.45,64.29 0 top
JP29  87.31,64.29 0 top
JP30  90.01,64.29 0 top
JP31  92.87,64.29 0 top
JP32  95.57,64.29 0 top
JP33  25.88,110.49 0 top
JP34  [1X02']  18.57,110.49 0 top
OPAMP  33.5,103.19 180 top
R_ADJ1  25.08,89.53 180 top
R_ADJ2  34.92,97 270 top
R_SET  40.32,76.84 270 top
RN1  41.59,103.19 90 top
U1  9.21,68.58 0 top
U$1  28.26,94.77 270 top
X2  10,95.57 90 top
X4  85.88,105.89 0 top
X5  85.88,8.73 0 top

### Tracks (layer width: path | path; a pad name or v marks a point on that pad's centre or on a via)
ARD_5V  (2 unrouted)
  Top 0.254: DIGITAL_ISO1.1 19.37,83.03 | U1.2 5.33,71.5 4.92,71.91 4.92,97.79 5.4,98.27 11.23,98.27 X2.4
  Top 0.406: C_ISO1B.1 24.43,83.27 DIGITAL_ISO1.1
  Bottom 0.254: 16.67,7.14 16.67,97.31 15.72,98.27 11.32,98.27 X2.4
CLK_OUT
  Top 0.254: 44.77,92.54 DDS.5 45.72,91.58 45.72,89.38 44.12,87.78 CLOCK.1
COMP
  Top 0.254: C_DDS3.2 41.13,93.49 41.75,92.87 42.45,92.87 DDS.1
FSYNC  (via drill 0.6)
  Top 0.254: DIGITAL_ISO1.14 35.4,80.49 v36.04,79.85 | v42.86,99.54 43.34,99.54 43.66,99.22 43.66,97.13 DDS.8
  Bottom 0.254: v36.04,79.85 36.67,79.85 36.99,80.17 36.99,90.96 38.1,92.08 38.58,92.08 39.21,92.71 40.32,92.71 40.48,92.87 40.48,99.38 40.64,99.54 v42.86,99.54
FSYNC_ARD
  Top 0.254: 8.57,68.25 10.64,68.25 | 10.64,68.25 U1.18 9.54,68.25 9.53,68.26 | U1.9 8.93,66.95 | 9.53,66.95 U1.16 | U1.11 9.59,65.66 | 9.59,65.66 U1.14 | U1.7 8.57,68.25 | 10.64,68.25 10.64,69.22 10.97,69.55 U1.20 U1.5 5.25,69.55 4.6,68.9 3.18,68.9 2.7,69.37 2.7,98.74 3.65,99.7 8.72,99.7 X2.9 | 9.59,65.66 9.59,66.89 9.53,66.95 | 9.53,66.95 8.93,66.95 | 8.93,66.95 8.57,67.31 8.57,68.25
FSYNC_IN  (1 unrouted)
GND  (via drill 0.5, 0.6)
  Top 0.254: C_BIAS.2 21.43,91.28 21.43,90.01 22.07,89.38 v23.81,89.38 | C_IN.2 27.62,101.6 v27.62,100.49 | R_ADJ1.1 25.34,89.63 25.72,90.01 26.35,90.01 | U1.4 U1.21 4.64,70.21 v3.97,70.17
  Top 0.406: U$1.GND@7 U$1.GND@11 U$1.GND@10 | U$1.GND@10 U$1.GND@6 U$1.GND@7 | U$1.GND@7 U$1.GND@5 | U$1.GND@5 U$1.GND@4 | U$1.GND@4 U$1.GND@8 | U$1.GND@8 U$1.GND@12 | U$1.GND@12 U$1.GND@15 | U$1.GND@12 U$1.GND@13 | U$1.GND@10 U$1.GND@14 U$1.GND@13 | U$1.GND@10 U$1.GND@9 | U$1.GND@9 U$1.GND@8 | U$1.GND@9 U$1.GND@13 | U$1.GND@10 26.35,90.01 v26.35,89.22 | U$1.GND@16 v23.81,89.38 | U$1.GND@4 U$1.GND@3 U$1.GND@2 U$1.GND@1 v27.62,100.49 | C_ISO1A.2 24.18,81.74 DIGITAL_ISO1.2 v19.37,81.76 | DIGITAL_ISO1.7 25.4,75.41 25.73,75.74 C_ISO1B.2 v25.72,86.36 | DIGITAL_ISO1.7 v21.59,75.41 | DIGITAL_ISO1.7 DIGITAL_ISO1.8 | U$1.GND@9 U$1.GND@5
  Gnd 0.406: v26.35,89.22 26.35,88.58 | v23.81,89.38 23.81,88.74 | v27.62,100.49 27.62,101.12 | v25.72,86.36 25.72,87.15 | v21.59,75.41 20.8,75.41 | v19.37,81.76 19.05,81.76 18.89,81.6
  Gnd 0.61: X2.6 18.4,97.64 18.57,97.47
  pour Gnd: 28.26,113.98 16.99,113.98 18.1,66.2 28.26,66.2
  pour Gnd: 19.53,63.34 -6.98,63.34 -6.98,64.14 -6.03,64.14 -6.03,115.09 19.84,115.09 19.84,114.3 19.53,114.3
GND_CS  (via drill 0.5, 0.6)
  Top 0.254: R_ADJ2.2 v34.92,94.77 | C_OUT1.1 34.92,92.71 v34.92,94.77 | C_OUT2.1 36.83,97 36.83,95.89 35.72,94.77 v34.92,94.77 | C_DDS_BYP1.2 C_DDS_BYP2.2 41.75,89.54 42.23,89.06 44.45,89.06 44.94,89.55 C_DDS4.1 44.2,90.91 DDS.4 | R_SET.1 40.38,77.63 41.28,77.63 41.59,77.95 42.13,77.95 CLOCK.3 CLOCK.2 | OPAMP.4 37.64,104.15 | RN1.5 40.26,104.62 38.1,104.62 37.64,104.15 | 37.64,104.15 v37.62,104.14 | DDS.9 43.19,98.1 43.02,98.27 v41.59,98.27
  Top 0.406: U$1.VOUT-@2 U$1.VOUT-@1 U$1.VOUT-@4 | U$1.VOUT-@2 U$1.VOUT-@3 U$1.VOUT-@6 | U$1.VOUT-@6 U$1.VOUT-@9 U$1.VOUT-@8 U$1.VOUT-@7 U$1.VOUT-@4 | U$1.VOUT-@4 U$1.VOUT-@5 | U$1.VOUT-@6 U$1.VOUT-@5 | U$1.VOUT-@5 U$1.VOUT-@2 | U$1.VOUT-@4 v34.92,94.77 | DIGITAL_ISO1.9 32.23,74.14 32.05,74.31 C_ISO2B.2 32.05,86.5 v32.07,86.52 | DIGITAL_ISO1.9 34.29,74.14 | CLOCK.3 42.24,78.41 41.28,79.38 v40.16,79.38 | C_DDS_BYP1.2 v40.48,88.11 | v38.26,81.76 38.24,81.74 C_ISO2A.2 34.15,81.74 34.13,81.76 DIGITAL_ISO1.15 | DIGITAL_ISO1.9 v36.04,74.14
  Gnd 0.254: v37.62,104.14 37.62,103.82 | v41.59,98.27 41.28,98.27
  Gnd 0.406: v34.92,94.77 35.56,94.77 | v40.16,79.38 39.85,79.38 | v40.48,88.11 40.48,87.63 | v38.26,81.76 38.42,81.76 | v32.07,86.52 32.07,87 | v36.04,74.14 36.51,74.14
  pour Gnd: 29.53,92.39 29.53,72.23 46.67,72.23 46.36,92.39
  pour Gnd: 29.53,93.03 38.89,93.03 38.89,91.6 46.36,91.28 46.36,105.41 29.69,105.57 29.69,97.16 39.05,97.16 39.05,96.52 29.53,96.52
  pour Gnd: 29.53,105.89 49.37,105.89 49.37,97.16 29.53,97.16
IOUT
  Top 0.254: OPAMP.3 36.5,103.52 36.99,103.03 38.74,103.03 39.69,103.98 41.12,103.98 43.02,102.08 45.39,102.08 RN1.2 RN1.1 47.27,100.72 I_OUT.1
N$1
  Top 0.254: DDS.3 43.7,90.22 C_DDS4.2
N$2
  Top 0.254: U$1.BYP 32.07,97.95 34.45,97.95 34.68,98.18 C_BYP.1
N$3
  Top 0.254: RN1.3 RN1.4 44.67,105.41 34.45,105.41 34.29,105.25 34.29,103.19 34.62,102.86 OPAMP.2
N$4
  Top 0.254: 43.18,75.41 43.18,74.45 42.86,74.14 39.21,74.14 38.89,74.45 38.89,76.52 39.21,76.84 42.86,76.84 43.18,76.52 43.18,75.88
N$5
  Vdd 0.406: 24.13,74.14 22.7,74.14 22.7,73.98 23.97,73.98
N$7
  Top 0.254: RN1.6 RN1.7 40.18,101.92 37.78,101.92 37.48,102.22 OPAMP.1
N$8
  Top 0.254: CLOCK.4 42.19,75.57 41.59,75.57 41.28,75.88 40.42,75.88 R_SET.2
N$10
  Top 0.254: U$1.BIAS C_BIAS.1
N$11
  Top 0.254: 25.14,90.9 U$1.ADJ1 24.83,90.71 R_ADJ1.2
N$13
  Top 0.254: U$1.ADJ2 32.77,97.25 R_ADJ2.1
OUT_1  (1 unrouted)
  Top 0.61: X4.1 X5.1
OUT_2  (1 unrouted)
  Top 0.61: X4.2 63.81,10.03 X5.2
OUT_3  (1 unrouted)
  Top 0.61: X4.3 X5.3
OUT_4  (1 unrouted)
  Top 0.61: X4.4 X5.4
OUT_5  (1 unrouted)
  Top 0.61: X4.5 72.09,10.03 X5.5
OUT_6  (1 unrouted)
  Top 0.61: X4.6 X5.6
OUT_7  (1 unrouted)
  Top 0.61: X4.7 X5.7
OUT_8  (1 unrouted)
  Top 0.61: X4.8 X5.8
OUT_9  (1 unrouted)
  Top 0.61: X4.9 X5.9
OUT_10  (1 unrouted)
  Top 0.61: X4.10 X5.10
OUT_11  (1 unrouted)
  Top 0.61: X5.11 X4.11
OUT_12  (1 unrouted)
  Top 0.61: X4.12 X5.12
OUT_13  (1 unrouted)
  Top 0.61: X4.13 X5.13
OUT_14  (1 unrouted)
  Top 0.61: X4.14 X5.14
OUT_15  (1 unrouted)
  Top 0.61: X4.15 99.7,10.03 X5.15
OUT_16  (1 unrouted)
  Top 0.61: X4.16 X5.16
OUT_17  (1 unrouted)
  Top 0.61: X4.17 X5.17
OUT_18  (1 unrouted)
  Top 0.61: X4.18 107.98,10.03 X5.18
OUT_19  (1 unrouted)
  Top 0.61: X4.19 X5.19
OUT_20  (2 unrouted)
  Top 0.61: X4.20 62.41,6.85 62.23,6.67
OUT_21  (1 unrouted)
  Top 0.61: X4.21 X5.21
OUT_22  (1 unrouted)
  Top 0.61: X4.22 67.95,7.49 X5.22
OUT_23  (1 unrouted)
  Top 0.61: X4.23 X5.23
OUT_24  (1 unrouted)
  Top 0.61: X4.24 X5.24
OUT_25  (1 unrouted)
  Top 0.61: X4.25 X5.25
OUT_26  (1 unrouted)
  Top 0.61: X4.26 X5.26
OUT_27  (1 unrouted)
  Top 0.61: X4.27 X5.27
OUT_28  (1 unrouted)
  Top 0.61: X4.28 X5.28
OUT_29  (1 unrouted)
  Top 0.61: X4.29 X5.29
OUT_30  (1 unrouted)
  Top 0.61: X4.30 X5.30
OUT_31  (1 unrouted)
  Top 0.61: X4.31 X5.31
OUT_32  (1 unrouted)
  Top 0.61: X4.32 95.56,7.49 X5.32
OUT_33
  Top 0.61: X4.33 X5.33
OUT_34
  Top 0.61: X4.34 X5.34
OUT_35
  Top 0.61: X4.35 103.84,7.49 X5.35
OUT_36
  Top 0.61: X4.36 X5.36
OUT_37
  Top 0.61: X4.37 X5.37
SCLK  (via drill 0.6)
  Top 0.254: DIGITAL_ISO1.12 35.24,77.95 v35.88,77.31 | DDS.7 44.2,98.81 44.45,99.06 v45.4,99.06
  Bottom 0.254: v35.88,77.31 36.35,77.31 40.01,80.96 40.01,83.82 40.8,84.61 42.7,84.61 46.04,87.95 46.04,98.43 v45.4,99.06
SCLK_IN  (1 unrouted)
  Bottom 0.254: X2.2 14.01,92.82 14.76,92.08 14.76,7.46 14.92,7.3
SDATA  (via drill 0.6)
  Top 0.254: DIGITAL_ISO1.13 34.92,79.22 35.56,78.58 37.15,78.58 v41.75,83.19 | v45.72,83.19 46.35,83.82 46.35,96.52 45.88,97 44.78,97 DDS.6
  Bottom 0.254: v41.75,83.19 v45.72,83.19
SDATA_IN  (1 unrouted)
  Bottom 0.254: X2.3 14.6,95.57 15.72,94.46 15.72,7.14
SW_SCLK
  Top 0.254: 7.62,74.14 14.29,80.8 14.29,87.07 X2.1
  Top 0.406: U1.1 6.39,72.9 7.62,74.14
SW_~RESET
  Top 0.254: U1.23 12.76,71.5 13.34,72.07 13.34,77.79 16.35,80.8 16.35,93.03 12.38,97 8.79,97 X2.8
SW_~SYNC  (via drill 0.6)
  Top 0.254: U1.24 12.03,72.9 11.27,73.66 11.27,76.68 15.4,80.8 15.4,91.12 12.38,94.14 v8.79,94.14
  Bottom 0.254: v8.79,94.14 X2.7
V_SINE
  Top 0.254: DDS.10 40.55,97.09 40.01,97.63 40.01,100.44 RN1.8
VDD  (via drill 0.5)
  Top 0.254: C_IN.1 23.81,101.6 v23.81,100.49
  Top 0.406: U$1.VIN@2 U$1.VIN@4 U$1.VIN@3 | U$1.VIN@1 U$1.VIN@3 | U$1.VIN@2 25.08,98.74 24.92,98.58 U$1.VIN@3 | U$1.RUN U$1.VIN@2 | U$1.VIN@3 v23.81,100.49
  Vdd 0.406: 23.5,86.52 23.5,86.84 22.86,86.84
  Gnd 0.406: v23.81,100.49 23.81,101.6
  pour Vdd: 28.42,113.98 16.99,113.98 16.99,66.2 28.42,66.2
VDD_CS_ANA  (via drill 0.5, 0.6)
  Top 0.254: C_BYP.2 v34.92,100.17 35.87,100.17 C_OUT2.2
  Top 0.406: U$1.VOUT2@4 U$1.VOUT2@3 U$1.VOUT2@2 U$1.VOUT2@1 v34.92,100.17 | OPAMP.8 31.29,100.66 v31.27,100.65
  Vdd 0.406: v31.27,100.65 31.27,100.17
  pour Vdd: 29.53,96.84 29.53,105.89 46.2,105.89 46.2,96.84
VDD_CS_DIG  (via drill 0.5, 0.6)
  Top 0.254: C_OUT1.2 33.97,89.22 v32.7,89.22 | DDS.2 43.18,92.61 43.18,91.28 43.02,91.12 42.7,91.12 42.21,91.61 C_DDS_BYP2.1 C_DDS_BYP1.1 39.83,92.26 | C_DDS3.1 39.83,92.26 | 39.83,92.26 40.48,91.6 39.53,91.6 v39.05,91.12
  Top 0.406: U$1.VOUT1@5 U$1.VOUT1@6 U$1.VOUT1@3 U$1.VOUT1@2 | U$1.VOUT1@4 U$1.VOUT1@5 | U$1.VOUT1@2 U$1.VOUT1@1 U$1.VOUT1@4 | U$1.VOUT1@5 U$1.VOUT1@2 | U$1.VOUT1@4 v32.7,89.22 | CLOCK.6 44.12,75.26 v44.93,74.45 | v36.04,84.93 C_ISO2A.1 36.02,83.03 DIGITAL_ISO1.16 33.35,83.27 C_ISO2B.1
  Vdd 0.254: v39.05,91.12 38.74,90.81
  Vdd 0.406: v32.7,89.22 32.7,88.42 | v44.93,74.45 45.08,74.45 45.4,74.14 | v36.04,84.93 36.04,85.57
  pour Vdd: 29.53,92.55 29.53,72.23 46.67,72.23 46.2,92.55